# Altium schematic sheet Circuit_comp.SchDoc
size A4
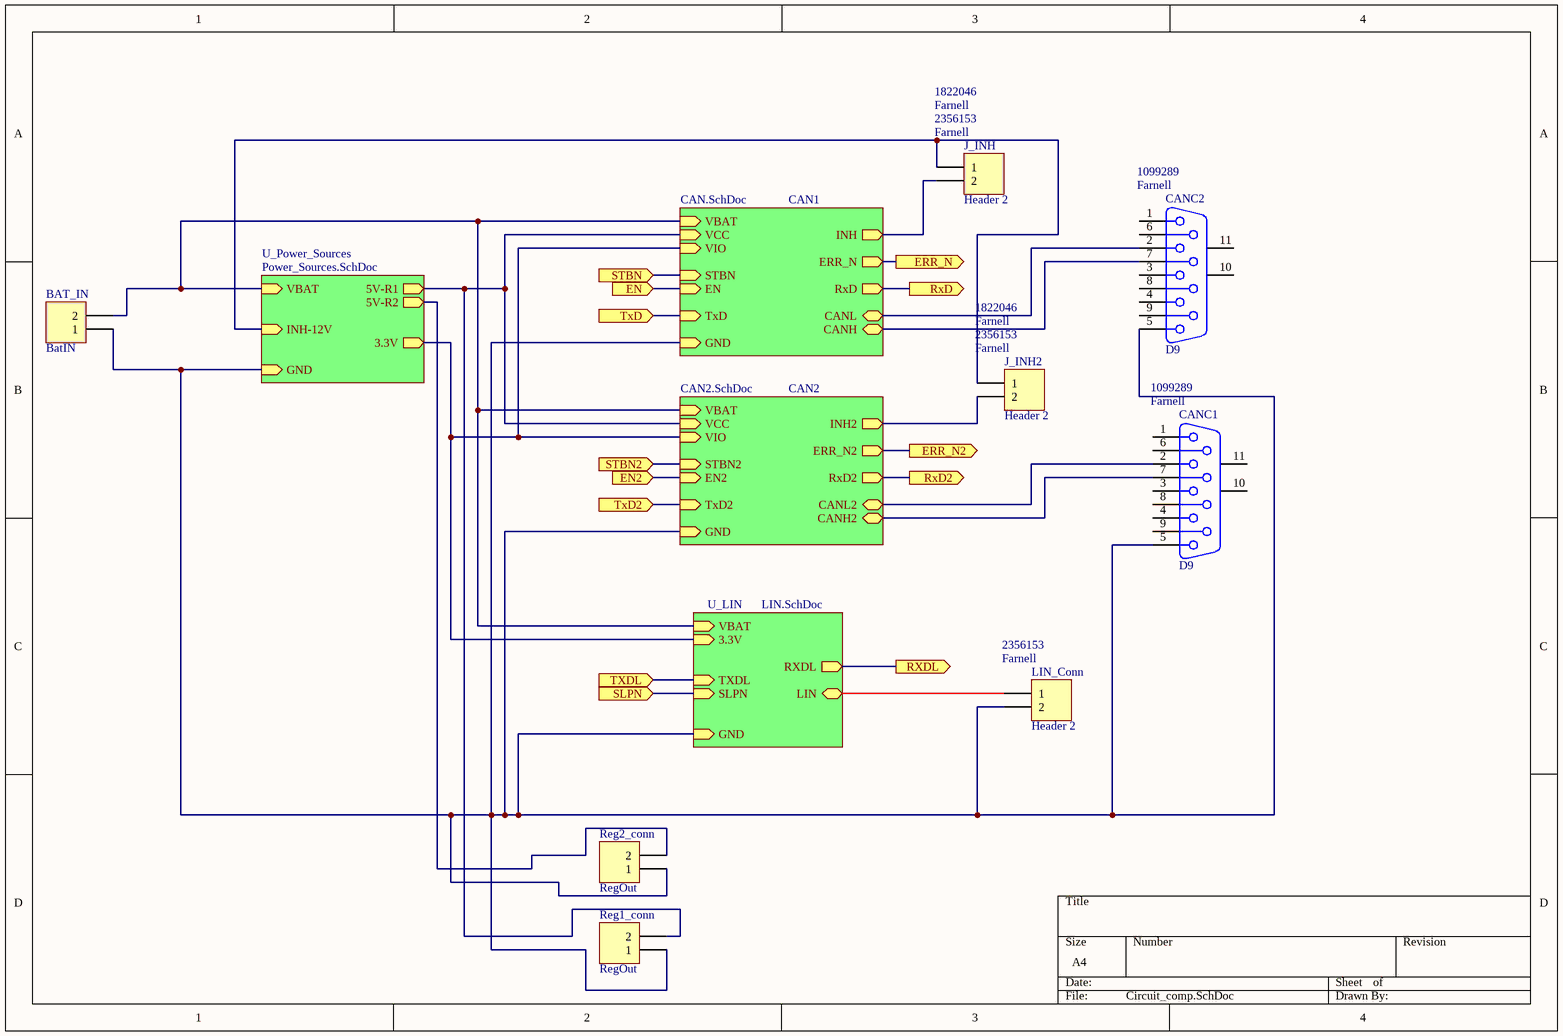
[diagram p0: Circuit_comp.SchDoc]

## Parts
BAT_IN  BatIN  [HDR1X2]
CANC1  D9  Supplier 1: Farnell  Supplier Part Number 1: 1099289  [DSUB1.385-2H9]
CANC2  D9  Supplier 1: Farnell  Supplier Part Number 1: 1099289  [DSUB1.385-2H9]
J_INH  Header 2  Supplier 1: Farnell  Supplier Part Number 1: 2356153  Supplier Part Number 2: 1822046  [HDR1X2]
J_INH2  Header 2  Supplier 1: Farnell  Supplier Part Number 1: 2356153  Supplier Part Number 2: 1822046  [HDR1X2]
LIN_Conn  Header 2  Supplier 1: Farnell  Supplier Part Number 1: 2356153  [HDR1X2]
Reg1_conn  RegOut  [HDR1X2]
Reg2_conn  RegOut  [HDR1X2]

## Sub-sheets
CAN1 = CAN.SchDoc: VCC (in), VIO (in), GND (in), INH (out), CANH (bidir), CANL (bidir), STBN (in), EN (in), ERR_N (out), TxD (in), RxD (out), VBAT (in)
CAN2 = CAN2.SchDoc: VCC (in), VIO (in), GND (in), INH2 (out), CANH2 (bidir), CANL2 (bidir), STBN2 (in), EN2 (in), ERR_N2 (out), TxD2 (in), RxD2 (out), VBAT (in)
U_LIN = LIN.SchDoc: VBAT (in), LIN (bidir), SLPN (in), RXDL (out), TXDL (in), GND (in), 3.3V (in)
U_Power_Sources = Power_Sources.SchDoc: VBAT (in), GND (in), INH-12V (in), 5V-R1 (out), 5V-R2 (out), 3.3V (out)

## Ports
EN2 (in), EN (in), ERR_N2 (out), ERR_N (out), RxD2 (out), RxD (out), RXDL (out), SLPN (in), STBN2 (in), STBN (in), TxD2 (in), TxD (in), TXDL (in)

## Nets
EN: port EN, sheet CAN1/EN
EN2: port EN2, sheet CAN2/EN2
ERR_N: port ERR_N, sheet CAN1/ERR_N
ERR_N2: port ERR_N2, sheet CAN2/ERR_N2
RxD: port RxD, sheet CAN1/RxD
RxD2: port RxD2, sheet CAN2/RxD2
RXDL: port RXDL, sheet U_LIN/RXDL
SLPN: port SLPN, sheet U_LIN/SLPN
STBN: port STBN, sheet CAN1/STBN
STBN2: port STBN2, sheet CAN2/STBN2
TxD: port TxD, sheet CAN1/TxD
TxD2: port TxD2, sheet CAN2/TxD2
TXDL: port TXDL, sheet U_LIN/TXDL
NetBAT_IN_1: BAT_IN.1 CANC1.5 CANC2.5 LIN_Conn.2 Reg1_conn.1 Reg2_conn.1 ; sheet CAN1/GND, sheet U_LIN/GND, sheet U_Power_Sources/GND, sheet CAN2/GND
NetBAT_IN_2: BAT_IN.2 ; sheet CAN1/VBAT, sheet U_LIN/VBAT, sheet U_Power_Sources/VBAT, sheet CAN2/VBAT
NetCANC1_2: CANC1.2 ; sheet CAN2/CANL2
NetCANC1_7: CANC1.7 ; sheet CAN2/CANH2
NetCANC2_2: CANC2.2 ; sheet CAN1/CANL
NetCANC2_7: CANC2.7 ; sheet CAN1/CANH
NetJ_INH2_2: J_INH2.2 ; sheet CAN2/INH2
NetJ_INH_1: J_INH.1 J_INH2.1 ; sheet U_Power_Sources/INH-12V
NetJ_INH_2: J_INH.2 ; sheet CAN1/INH
NetLIN_Conn_1: LIN_Conn.1 ; sheet U_LIN/LIN
NetReg1_conn_2: Reg1_conn.2 ; sheet CAN1/VCC, sheet U_Power_Sources/5V-R1, sheet CAN2/VCC
NetReg2_conn_2: Reg2_conn.2 ; sheet U_Power_Sources/5V-R2
(unnamed): sheet CAN1/VIO, sheet U_LIN/3.3V, sheet U_Power_Sources/3.3V, sheet CAN2/VIO

Not connected (* = marked no-connect by the designer): CANC1 1 3 4 6 8 9 10(MH1) 11(MH2); CANC2 1 3 4 6 8 9 10(MH1) 11(MH2)

## Library data of the parts
BAT_IN J_INH J_INH2 LIN_Conn Reg1_conn Reg2_conn = Header 2: Header, 2-Pin; LatestRevisionDate: 17-Jul-2002; LatestRevisionNote: Re-released for DXP Platform.; Publisher: Altium Limited
  BAT_IN: Supplier Part Number 1: 612-0150; Supplier 1: RS
  J_INH J_INH2: Supplier 2: Farnell
CANC1 CANC2 = D Connector 9: Receptacle Assembly, 9 Position, Right Angle; PackageDocument: O; Positions: 9; Published: 15-Jun-2001; LatestRevisionDate: 17-Jul-2002; LatestRevisionNote: Re-released for DXP Platform.; DatasheetDocument: 1-Sep-1999; PackageReference: 788750; Publisher: Altium Limited; Orientation: Right Angle; Gender: Receptacle